# EAGLE design POVBase (EAGLE 7.6.0)
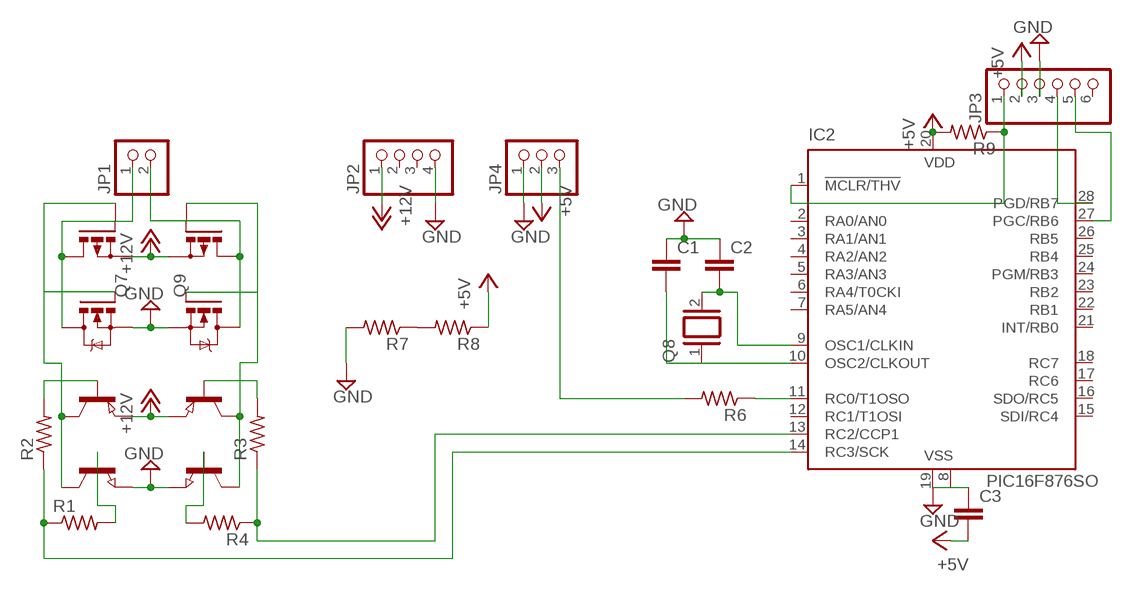
[diagram p0: schematic, sheet 1]

## Parts
C1  C-EUC0805  [C0805]
C2  C-EUC0805  [C0805]
C3  C-EUC0805  [C0805]
IC2  PIC16F876SO  [SO28W]
JP1  PINHD-1X2  [1X02]
JP2  PINHD-1X4  [1X04]
JP3  PINHD-1X6  [1X06]
JP4  PINHD-1X3  [1X03]
Q1  NPN-TRANSISTOR_SOT23  [SOT23]
Q2  NPN-TRANSISTOR_SOT23  [SOT23]
Q3  PNP-TRANSISTOR_SOT23  [SOT23]
Q4  PNP-TRANSISTOR_SOT23  [SOT23]
Q5  IRF540  [TO220BV]
Q6  IRF540  [TO220BV]
Q7  PMOSFET_PTO220BV  [TO220BV]
Q8  XTAL/S  [QS]
Q9  PMOSFET_PTO220BV  [TO220BV]
R1  R-US_R0805  [R0805]
R2  R-US_R0805  [R0805]
R3  R-US_R0805  [R0805]
R4  R-US_R0805  [R0805]
R6  R-US_R0805  [R0805]
R7  R-US_R0805  [R0805]
R8  R-US_R0805  [R0805]
R9  R-US_R0805  [R0805]

## Nets
+5V: C3.2 IC2.20(VDD) JP3.2 JP4.2 R8.1 R9.2
+12V: JP2.1 Q3.2(E) Q4.2(E) Q7.S Q9.S
GND: C1.1 C2.1 C3.1 IC2.8(VSS) IC2.19(VSS) JP2.4 JP3.3 JP4.1 Q1.2(E) Q2.2(E) Q5.S Q6.S R7.2
N$1: Q1.3(C) Q3.3(C) Q5.G Q7.G
N$2: Q1.1(B) R1.2
N$3: Q2.1(B) R4.2
N$4: Q2.3(C) Q4.3(C) Q6.G Q9.G
N$5: Q3.1(B) R2.2
N$6: Q4.1(B) R3.2
N$7: IC2.14(RC3/SCK) R1.1 R2.1
N$8: IC2.13(RC2/CCP1) R3.1 R4.1
N$9: JP4.3 R6.2
N$10: JP1.2 Q6.D Q9.D
N$11: JP1.1 Q5.D Q7.D
N$12: IC2.1(!MCLR/THV) JP3.1 R9.1
N$13: IC2.28(PGD/RB7) JP3.4
N$14: IC2.27(PGC/RB6) JP3.5
N$15: IC2.11(RC0/T1OSO) R6.1
N$16: C1.2 IC2.10(OSC2/CLKOUT) Q8.1
N$17: C2.2 IC2.9(OSC1/CLKIN) Q8.2
N$20: R7.1 R8.2
Unconnected: IC2.2(RA0/AN0) IC2.3(RA1/AN1) IC2.4(RA2/AN2) IC2.5(RA3/AN3) IC2.6(RA4/T0CKI) IC2.7(RA5/AN4) IC2.12(RC1/T1OSI) IC2.15(SDI/RC4) IC2.16(SDO/RC5) IC2.17(RC6) IC2.18(RC7) IC2.21(INT/RB0) IC2.22(RB1) IC2.23(RB2) IC2.24(PGM/RB3) IC2.25(RB4) IC2.26(RB5) JP2.2 JP2.3 JP3.6

## Library data of the parts
C1-C3 = resistor:C-EU: CAPACITOR, European symbol
IC2 = microchip:PIC16*876: MICROCONTROLLER flash type; MF: MICROCHIP; MPN: PIC16F876-20/SO; OC_FARNELL: 9761268; OC_NEWARK: 12C1950
JP1 = pinhead:PINHD-1X2: PIN HEADER
JP2 = pinhead:PINHD-1X4: PIN HEADER
JP3 = pinhead:PINHD-1X6: PIN HEADER
JP4 = pinhead:PINHD-1X3: PIN HEADER
Q1 Q2 = semicon-smd-ipc:NPN-TRANSISTOR_: NPN TRANSISTOR
Q3 Q4 = semicon-smd-ipc:PNP-TRANSISTOR_: PNP TRANSISTOR
Q5 Q6 = transistor-power:IRF540: HEXFET Power MOSFET
Q7 Q9 = transistor-power:PMOSFET_P: Power MOSFET P-Channel
Q8 = special:XTAL/S: CRYSTAL
R1-R4 R6-R9 = resistor:R-US_: RESISTOR, American symbol

## Board
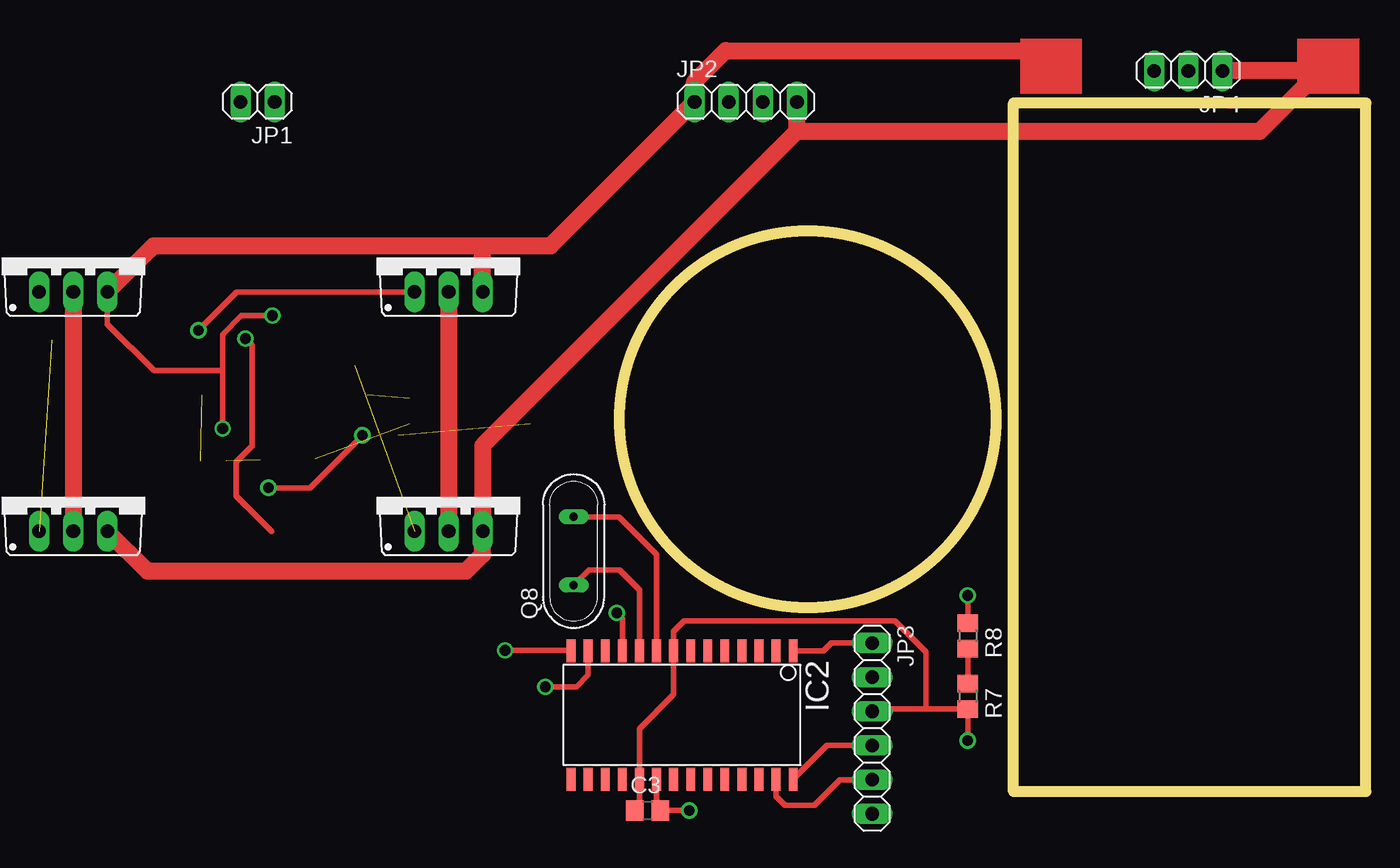
[diagram p1: board, top side]
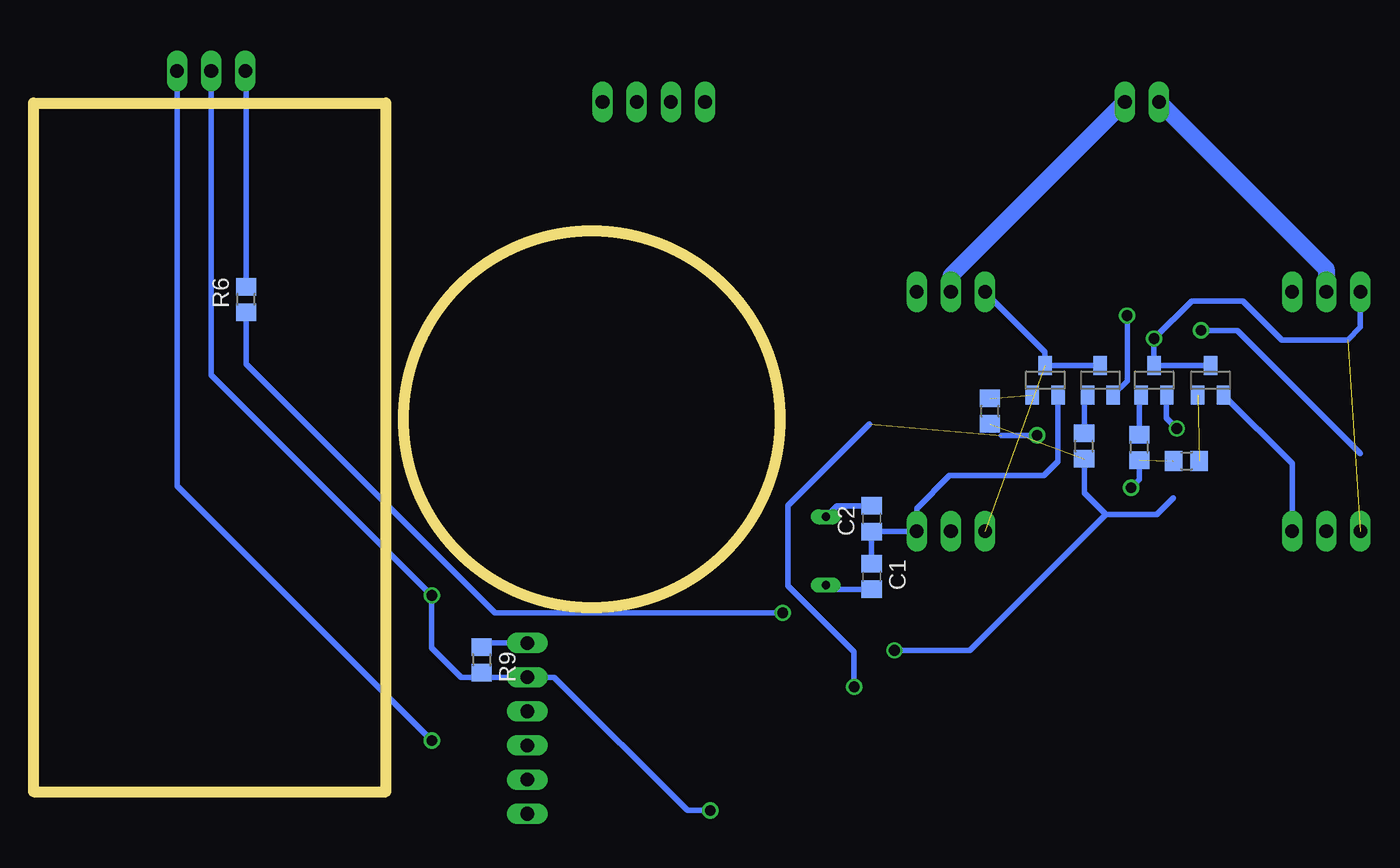
[diagram p2: board, bottom side, seen from below]

Size 55.5 x 51.2 mm. Coordinates in mm from the lower left corner, seen from the top.
Outline: 55.5,0 29.3,0 29.3,51.2 55.5,51.2 55.5,0
Outline: circle at 14,27.7 radius 14
Copper layers (1*16): Top 0.035mm / dielectric 1.5mm / Bottom 0.035mm
Design rules "default": minimum track width 10mil, minimum drill 24mil, track to track 8mil, track to pad 8mil, pad to pad 8mil, via to via 8mil, smd to smd 8mil, copper to edge 40mil, drill to drill 8mil, minimum pad ring 10mil, minimum via ring 8mil, stop-mask expansion 4mil, vias tented up to drill 0mil, thermal gap 10mil

### Footprints (pad centres in the part's own frame; a part is rotated, then mirrored left to right if it is on the bottom)
C0805 = smd 1.3 x 1.5: 1 -0.95,0; 2 0.95,0
SO28W = smd 0.65 x 1.7: 1 -7.62,-4.78; 2 -6.35,-4.78; 3 -5.08,-4.78; 4 -3.81,-4.78; 5 -2.54,-4.78; 6 -1.27,-4.78; 7 0,-4.78; 8 1.27,-4.78; 9 2.54,-4.78; 10 3.81,-4.78; 11 5.08,-4.78; 12 6.35,-4.78; 13 7.62,-4.78; 14 8.89,-4.78; 15 8.89,4.78; 16 7.62,4.78; 17 6.35,4.78; 18 5.08,4.78; 19 3.81,4.78; 20 2.54,4.78; 21 1.27,4.78; 22 0,4.78; 23 -1.27,4.78; 24 -2.54,4.78; 25 -3.81,4.78; 26 -5.08,4.78; 27 -6.35,4.78; 28 -7.62,4.78
1X02 = drill 1.016 long: 1 -1.27,0; 2 1.27,0
1X04 = drill 1.016 long: 1 -3.81,0; 2 -1.27,0; 3 1.27,0; 4 3.81,0
1X06 = drill 1.016 long: 1 -6.35,0; 2 -3.81,0; 3 -1.27,0; 4 1.27,0; 5 3.81,0; 6 6.35,0
1X03 = drill 1.016 long: 1 -2.54,0; 2 0,0; 3 2.54,0
SOT23 = smd 1 x 1.4: 1 -0.95,-1.1; 2 0.95,-1.1; 3 0,1.1
TO220BV = drill 1.016 long: D 0,-2.54; G -2.54,-2.54; S 2.54,-2.54
QS = drill 0.61 long: 1 -2.54,0; 2 2.54,0
R0805 = smd 1.3 x 1.5: 1 -0.95,0; 2 0.95,0

### Placement (x,y rotation side)
C1  -6.8,16 270 bottom  (outside the outline)
C2  -6.8,20.3 90 bottom  (outside the outline)
C3  2.1,-1.4 0 top
IC2  5.3,5.7 180 top
JP1  -26.9,51.3 180 top  (outside the outline)
JP2  9.4,51.3 0 top
JP3  18.8,4.7 270 top
JP4  42.3,53.6 180 top
Q1  -19.7,30.6 0 bottom  (outside the outline)
Q2  -32,30.6 0 bottom  (outside the outline)
Q3  -23.8,30.6 0 bottom  (outside the outline)
Q4  -27.8,30.6 0 bottom  (outside the outline)
Q5  -12.7,21.9 0 top  (outside the outline)
Q6  -40.6,21.9 0 top  (outside the outline)
Q7  -12.7,39.7 0 top  (outside the outline)
Q8  -3.4,17.9 90 top  (outside the outline)
Q9  -40.6,39.7 0 top  (outside the outline)
R1  -15.6,28.3 90 bottom  (outside the outline)
R2  -22.6,25.7 90 bottom  (outside the outline)
R3  -26.7,25.6 90 bottom  (outside the outline)
R4  -30.2,24.6 0 bottom  (outside the outline)
R6  39.7,36.6 90 bottom
R7  25.9,7.1 270 top
R8  25.9,11.6 270 top
R9  22.2,9.8 270 bottom

### Tracks (layer width: path | path; a pad name or v marks a point on that pad's centre or on a via)
+5V  (via drill 0.8)
  Top 0.406: R8.1 v25.9,14.6 | v5.2,-1.4 C3.2 2.76,-1.11 IC2.20
  Bottom 0.406: JP4.2 42.3,31 v25.9,14.6 25.9,10.7 23.71,8.51 22.3,8.51 | 21.76,8.51 JP3.2 | JP3.2 22.3,8.51 | JP3.2 16.81,8.51 6.9,-1.4 v5.2,-1.4 | R9.2 22.2,8.61 22.3,8.51
+12V  (via drill 0.8)
  Top 0.406: Q9.S -38.06,34.76 -34.6,31.3 -29.5,31.3 | v-25.8,35.4 -28.1,35.4 -29.5,34 -29.5,31.3 | v-29.5,27 -29.5,31.3
  Top 1.27: 31.2,55.1 7.9,55.1 5.59,52.79 JP2.1 -5.11,40.6 -10.16,40.6 | Q9.S -34.62,40.6 -10.16,40.6 | Q7.S -10.16,40.6
  Bottom 0.406: Q4.2 -28.7,29.45 -28.7,27.8 v-29.5,27 | Q3.2 -25.8,30.55 v-25.8,35.4
GND  (via drill 0.8)
  Top 0.406: v25.9,3.8 R7.2 22.8,6.15 | 22.8,6.15 18.98,6.15 JP3.3 | 22.8,6.15 22.8,10.4 20.5,12.7 4.8,12.7 4.03,11.93 IC2.8 4.03,7.23 1.49,4.69 IC2.19 1.49,-1.06 C3.1
  Top 1.27: 13.21,49.1 47.6,49.1 51.6,53.1 51.6,53.6 JP4.1 | 13.21,49.1 JP2.4 | Q6.S -35.1,16.4 -11.4,16.4 -10.16,17.64 Q5.S -10.16,25.73 13.21,49.1
  Bottom 0.406: Q1.2 -20.65,24.55 -19.6,23.5 -12.6,23.5 -10.16,21.06 Q5.S C2.1 C1.1 | v25.9,3.8 44.84,22.74 JP4.1 | Q2.2 -38.06,24.39 Q6.S
N$1  (via drill 0.8)  (1 unrouted)
  Top 0.406: Q7.G -28.44,37.16 v-31.3,34.3
  Bottom 0.406: Q3.3 Q1.3 | Q1.3 -19.84,31.84 | -43.14,25.16 -34,34.3 v-31.3,34.3 | Q7.G -19.7,32.7 Q1.3
N$2  (1 unrouted)
N$3  (1 unrouted)
N$4  (via drill 0.8)  (1 unrouted)
  Top 0.406: -25.86,19.36 -28.5,22 -28.5,24.5 -27.3,25.7 -27.3,33.2 v-27.8,33.7
  Bottom 0.406: Q2.3 Q4.3 v-27.8,33.7 -30.6,36.5 -34.4,36.5 -37.3,33.6 -42.2,33.6 -43.14,34.54 Q9.G
N$5
  Bottom 0.406: Q3.1 -22.6,29.25 R2.2
N$6
  Bottom 0.406: Q4.1 -26.7,29.35 R3.2
N$7  (via drill 0.8)  (1 unrouted)
  Top 0.406: IC2.14 -3.61,10.5 v-8.5,10.5
  Bottom 0.406: -29.25,21.85 -28,20.6 -24.2,20.6 | -24.2,20.6 -22.6,22.2 R2.1 | -24.2,20.6 -14.1,10.5 v-8.5,10.5
N$8  (via drill 0.8)  (2 unrouted)
  Top 0.406: v-19.1,26.5 -23,22.6 v-26.1,22.6 | IC2.13 -2.32,8.68 -3.2,7.8 v-5.5,7.8
  Bottom 0.406: R3.1 -26.7,23.2 v-26.1,22.6 | -16.45,26.5 v-19.1,26.5 | v-5.5,7.8 -5.5,10.4 -0.6,15.3 -0.6,21.3 -6.65,27.35
N$9
  Bottom 0.406: JP4.3 39.7,53.54 R6.2
N$10
  Top 1.27: Q9.D Q6.D
  Bottom 1.27: JP1.2 -40.6,38.87 Q9.D
N$11
  Top 1.27: Q7.D Q5.D
  Bottom 1.27: JP1.1 -12.7,38.37 Q7.D
N$12
  Top 0.406: IC2.1 15.18,10.48 15.75,11.05 JP3.1
  Bottom 0.406: JP3.1 21.9,11.05 R9.1
N$13
  Top 0.406: JP3.4 15.43,3.43 IC2.28
N$14
  Top 0.406: JP3.5 16.39,0.89 14.5,-1 12.3,-1 11.65,-0.35 IC2.27
N$15  (via drill 0.8)
  Top 0.406: IC2.11 0.22,12.88 v-0.2,13.3
  Bottom 0.406: v-0.2,13.3 21.2,13.3 39.7,31.8 R6.1
N$16
  Top 0.406: Q8.1 -2.26,16.5 0,16.5 1.49,15.01 IC2.10
  Bottom 0.406: Q8.1 -3.71,15.05 C1.2
N$17
  Top 0.406: Q8.2 -0.04,20.44 2.76,17.64 IC2.9
  Bottom 0.406: C2.2 -4.21,21.25 Q8.2
N$20
  Top 0.406: R8.2 R7.1
(copper drawn outside any net)
  shapes: Top area x2